# Altium schematic sheet WiFi-BLE Module.SchDoc: WiFi GPRS Combo
size A4; SheetSize: A4
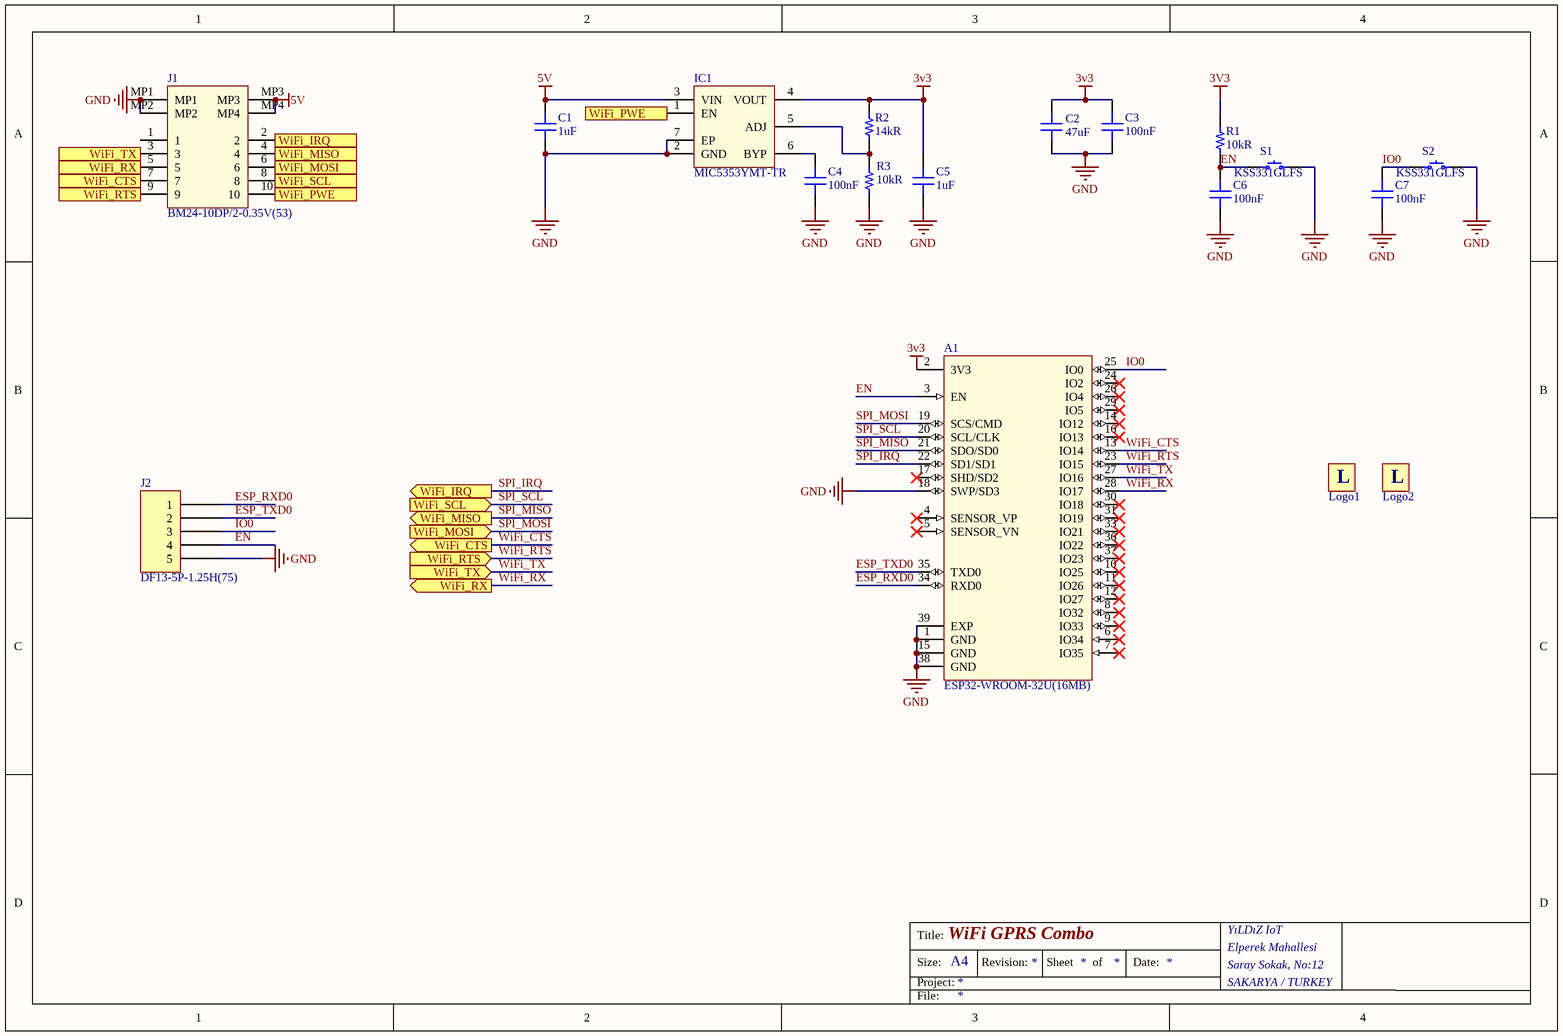
[diagram p0: WiFi-BLE Module.SchDoc]

## Parts
A1  ESP32-WROOM-32U(16MB)  [ESP32-WROOM-32U]
C1  1uF  [CAP 0603/1608]
C2  47uF  [CAP 0603/1608]
C3  100nF  [CAP 0603/1608]
C4  100nF  [CAP 0603/1608]
C5  1uF  [CAP 0603/1608]
C6  100nF  [CAP 0603/1608]
C7  100nF  [CAP 0603/1608]
IC1  MIC5353YMT-TR  [MICREL MLF-6 1.6x1.6MM]
J1  BM24-10DP/2-0.35V(53)  [HIROSE BM2410DP]
J2  DF13-5P-1.25H(75)  [HIROSE DF13-5P-1.25H]  (no BOM)
Logo1  Logo symbol  [LOGO_YILDIZIOT]  (value not drawn)  (no BOM)
Logo2  Logo symbol  [LOGO_YILDIZIOT]  (value not drawn)  (no BOM)
R1  10kR  [RES 0603/1608]
R2  14kR  [RES 0603/1608]
R3  10kR  [RES 0603/1608]
S1  KSS331GLFS  [C&K KSS]  (no BOM)
S2  KSS331GLFS  [C&K KSS]  (no BOM)

## Ports
WiFi_CTS (in), WiFi_CTS (out), WiFi_IRQ (in), WiFi_IRQ (out), WiFi_MISO (in), WiFi_MISO (out), WiFi_MOSI (in), WiFi_MOSI (out), WiFi_PWE (in), WiFi_PWE (out), WiFi_RTS (in), WiFi_RTS (out), WiFi_RX (in), WiFi_RX (out), WiFi_SCL (in), WiFi_SCL (out), WiFi_TX (in), WiFi_TX (out)

## Nets
3v3: A1.2(3V3) C2.2 C3.2 C5.2 IC1.4(VOUT) R1.2 R2.2
5V: C1.2 IC1.3(VIN) J1.MP3 J1.MP4
GND: A1.1(GND) A1.15(GND) A1.18(SWP/SD3) A1.38(GND) A1.39(EXP) C1.1 C2.1 C3.1 C4.1 C5.1 C6.1 C7.1 IC1.2(GND) IC1.7(EP) J1.MP1 J1.MP2 J2.5 R3.2 S1.2 S2.1
EN: A1.3(EN) C6.2 J2.4 R1.1 S1.1
ESP_RXD0: A1.34(RXD0) J2.1
ESP_TXD0: A1.35(TXD0) J2.2
IO0: A1.25(IO0) C7.2 J2.3 S2.2
SPI_IRQ: A1.22(SD1/SD1) J1.2 ; port WiFi_IRQ
SPI_MISO: A1.21(SDO/SD0) J1.4 ; port WiFi_MISO
SPI_MOSI: A1.19(SCS/CMD) J1.6 ; port WiFi_MOSI
SPI_SCL: A1.20(SCL/CLK) J1.8 ; port WiFi_SCL
WiFi_CTS: A1.13(IO14) J1.7 ; port WiFi_CTS
WiFi_PWE: IC1.1(EN) J1.10 ; port WiFi_PWE
WiFi_RTS: A1.23(IO15) J1.9 ; port WiFi_RTS
WiFi_RX: A1.28(IO17) J1.5 ; port WiFi_RX
WiFi_TX: A1.27(IO16) J1.3 ; port WiFi_TX
NetC4_2: C4.2 IC1.6(BYP)
NetIC1_5: IC1.5(ADJ) R2.1 R3.1

Not connected (* = marked no-connect by the designer): A1 4(SENSOR_VP)* 5(SENSOR_VN)* 6(IO34)* 7(IO35)* 8(IO32)* 9(IO33)* 10(IO25)* 11(IO26)* 12(IO27)* 14(IO12)* 16(IO13)* 17(SHD/SD2)* 24(IO2)* 26(IO4)* 29(IO5)* 30(IO18)* 31(IO19)* 33(IO21)* 36(IO22)* 37(IO23)*; J1 1

## Notes on the sheet
- Title:
- Size:
- Project:
- Revision:
- Sheet
- of
- Date:
- YıLDıZ IoT
- Elperek Mahallesi
- Saray Sokak, No:12
- SAKARYA / TURKEY
- File:
- (in symbol Logo) L

## Library data of the parts
A1 = ESP ESP32-WROOM-32U: Wi-Fi/BT BLE Module ESP32-D0WD SPI Flash UART U.FL Conn.; Manufacturer: Espressif Systems; Supplier 1: Digi-Key; Supplier Part Number 1: 1904-1028-1-ND; Manufacturer Part Number: ESP32-WROOM-32U(16MB); Stock 1: 37; Pricing 1: 1 = 4,50000 (USD); RoHS: No; ComponentLink1URL: https://www.espressif.com/sites/default/files/documentation/esp32-wroom-32d_esp32-wroom-32u_datasheet_en.pdf?src-supplier=Digi-Key; ComponentLink1Description: https://www.espressif.com/sites/default/files/documentation/esp32-wroom-32d_esp32-wroom-32u_datasheet_en.pdf?src-supplier=Digi-Key
C1 C5 = Capacitor - Ceramic: Ceramic, SMT Capacitor; Manufacturer: Samsung; Manufacturer Part Number: CL10A105KP8NNNC; Tolerance: 10%; Voltage Rating: 10V; Dielectric: X5R; Supplier 1: Digi-Key; Supplier Part Number 1: 1276-1182-1-ND; Stock 1: 4590831; Pricing 1: 1 = 0,10000, 10 = 0,03800, 100 = 0,01680, 500 = 0,01200, 1000 = 0,00943 (USD); RoHS: Yes; Mount: Surface Mount; Case/Package: 0603; Case Code (Metric): 1608; Case Code (Imperial): 0603; Contact Plating: Tin; Min Operating Temperature: -55°C; Max Operating Temperature: 85°C; Packaging: Tape and Reel; Package Quantity: 1; Capacitance: 1uF; Voltage: 10V; Length: 1.6mm; Height: 0.8mm; Width: 0.031inch; Thickness: 0.035inch; Depth: 0.8mm; Radiation Hardening: No; ComponentLink1URL: https://datasheet.ciiva.com/15195/getdatasheetpartid-358616-15195708.pdf?src-supplier=Verical; ComponentLink1Description: https://datasheet.ciiva.com/15195/getdatasheetpartid-358616-15195708.pdf?src-supplier=Verical; ComponentLink2URL: https://datasheet.ciiva.com/16358/cl05b104kq5nnnc-16358431.pdf?src-supplier=Future+Electronics; ComponentLink2Description: https://datasheet.ciiva.com/16358/cl05b104kq5nnnc-16358431.pdf?src-supplier=Future+Electronics
C2 = Capacitor - Ceramic: Ceramic, SMT Capacitor; Manufacturer: Murata; Manufacturer Part Number: GRM32EC81C476KE15K; Voltage Rating (DC): 16V; Dielectric: X6S; Tolerance: 10%; ComponentLink1URL: http://www.samsungsem.com/kr/support/product-search/mlcc/CL10A475KO8NNNC.jsp; ComponentLink1Description: http://www.samsungsem.com/kr/support/product-search/mlcc/CL10A475KO8NNNC.jsp; ComponentLink2URL: https://www.verical.com/server-webapp/html/getDatasheet?partID=358619; ComponentLink2Description: https://www.verical.com/server-webapp/html/getDatasheet?partID=358619; ComponentLink3URL: https://produktinfo.conrad.com/datenblaetter/450000-474999/457663-da-01-en-VS_KONDENSATOR_0603.pdf; ComponentLink3Description: https://produktinfo.conrad.com/datenblaetter/450000-474999/457663-da-01-en-VS_KONDENSATOR_0603.pdf; ComponentLink4URL: https://www.yuden.co.jp/productdata/catalog/mlcc01_e.pdf; ComponentLink4Description: https://www.yuden.co.jp/productdata/catalog/mlcc01_e.pdf; ComponentLink5URL: https://www.verical.com/server-webapp/html/getDatasheet?partID=637532; ComponentLink5Description: https://www.verical.com/server-webapp/html/getDatasheet?partID=637532; ComponentLink6URL: http://www.yuden.co.jp/ut/product/category/capacitor/EMK325BJ476MM-T.pdf; ComponentLink6Description: http://www.yuden.co.jp/ut/product/category/capacitor/EMK325BJ476MM-T.pdf; ComponentLink7URL: http://www.farnell.com/datasheets/1693457.pdf; ComponentLink7Description: http://www.farnell.com/datasheets/1693457.pdf; ComponentLink8URL: http://www.mouser.com/ds/2/396/mlcc_all_e-1149778.pdf; ComponentLink8Description: http://www.mouser.com/ds/2/396/mlcc_all_e-1149778.pdf; ComponentLink9URL: http://www.onlinecomponents.com/productFiles/mf-TAI/75emk325bj476mm-t.pdf; ComponentLink9Description: http://www.onlinecomponents.com/productFiles/mf-TAI/75emk325bj476mm-t.pdf; Supplier 1: Digi-Key; Supplier Part Number 1: 490-16309-1-ND; Stock 1: 2282; Pricing 1: 1 = 0,78000, 10 = 0,57100, 100 = 0,39170, 500 = 0,31006, 1000 = 0,26110 (USD); Case/Package: 1210; Capacitance: 47uF; Length: 3.2mm; Width: 2.5mm; Thickness: 2.5mm; Price: 0,78
C3 C4 C6 C7 = Capacitor - Ceramic: Ceramic, SMT Capacitor; Manufacturer: Samsung; Manufacturer Part Number: CL10B104JB8NNNC; Tolerance: 5%; Voltage Rating: 50V; Dielectric: X7R; Supplier 1: Digi-Key; Supplier Part Number 1: 1276-1033-1-ND; Stock 1: 223594; Pricing 1: 1 = 0,10000, 10 = 0,05300, 100 = 0,02350, 500 = 0,01680, 1000 = 0,01320 (USD); RoHS: Yes; Mount: Surface Mount; Case/Package: 0603; Case Code (Metric): 1608; Case Code (Imperial): 0603; Material: Ceramic; Contact Plating: Tin; Min Operating Temperature: -55°C; Max Operating Temperature: 125°C; Packaging: Tape and Reel; Package Quantity: 1; Capacitance: 100nF; Voltage: 50V; Length: 1.6mm; Height: 0.8mm; Width: 0.031inch; Thickness: 0.035inch; Depth: 0.8mm; Radiation Hardening: No; ComponentLink1URL: https://media.digikey.com/pdf/Data%20Sheets/Samsung%20PDFs/CL_Series_MLCC_ds.pdf?src-supplier=Digi-Key; ComponentLink1Description: https://media.digikey.com/pdf/Data%20Sheets/Samsung%20PDFs/CL_Series_MLCC_ds.pdf?src-supplier=Digi-Key; ComponentLink2URL: https://www.verical.com/server-webapp/html/getDatasheet?partID=359321&src-supplier=Verical; ComponentLink2Description: https://www.verical.com/server-webapp/html/getDatasheet?partID=359321&src-supplier=Verical; ComponentLink3URL: http://www1.futureelectronics.com/doc/SAMSUNG/CL10B104JB8NNNC.pdf?src-supplier=Future+Electronics; ComponentLink3Description: http://www1.futureelectronics.com/doc/SAMSUNG/CL10B104JB8NNNC.pdf?src-supplier=Future+Electronics; ComponentLink4URL: https://produktinfo.conrad.com/datenblaetter/450000-474999/456613-da-01-en-VS_KONDENSATOR_0603.pdf?src-supplier=Conrad; ComponentLink4Description: https://produktinfo.conrad.com/datenblaetter/450000-474999/456613-da-01-en-VS_KONDENSATOR_0603.pdf?src-supplier=Conrad
IC1 = MICROCHIP MIC5353: Integrated Circuit; ComponentLink1URL: http://www.farnell.com/datasheets/2245202.pdf?src-supplier=Farnell; ComponentLink1Description: http://www.farnell.com/datasheets/2245202.pdf?src-supplier=Farnell; ComponentLink2URL: http://www.microchip.com/mymicrochip/filehandler.aspx?ddocname=en579989&src-supplier=Digi-Key; ComponentLink2Description: http://www.microchip.com/mymicrochip/filehandler.aspx?ddocname=en579989&src-supplier=Digi-Key; ComponentLink3URL: http://www.farnell.com/datasheets/1692673.pdf?src-supplier=Element14; ComponentLink3Description: http://www.farnell.com/datasheets/1692673.pdf?src-supplier=Element14; Supplier 1: Digi-Key; Supplier Part Number 1: 576-3681-1-ND; Manufacturer: Microchip; Manufacturer Part Number: MIC5353YMT-TR; Stock 1: 1004; Pricing 1: 1 = 0,34000, 25 = 0,28000, 100 = 0,26000 (USD); RoHS: Yes; ComponentLink4URL: https://datasheet.ciiva.com/2049/mic5353-2049344.pdf?src-supplier=Digi-Key; ComponentLink4Description: https://datasheet.ciiva.com/2049/mic5353-2049344.pdf?src-supplier=Digi-Key; ComponentLink5URL: https://datasheet.ciiva.com/2049/mic5353-2049342.pdf?src-supplier=Digi-Key; ComponentLink5Description: https://datasheet.ciiva.com/2049/mic5353-2049342.pdf?src-supplier=Digi-Key; ComponentLink6URL: https://datasheet.ciiva.com/2049/mic5353-2049343.pdf?src-supplier=Digi-Key; ComponentLink6Description: https://datasheet.ciiva.com/2049/mic5353-2049343.pdf?src-supplier=Digi-Key
J1 = 12 Pin (10 + 2 Power) B2B Header: Board to Board Connector; Manufacturer: Hirose; Pitch: 0.014inch; Mated Stacking Heights: 0.8mm; Supplier 1: Digi-Key; Supplier Part Number 1: H124923CT-ND; Manufacturer Part Number: BM24-10DP/2-0.35V(53); Stock 1: 2583; Pricing 1: 1 = 1,08000, 10 = 0,95400, 25 = 0,89760, 50 = 0,86020, 100 = 0,82280, 250 = 0,74800, 500 = 0,67320 (USD); RoHS: Yes; Mount: Surface Mount; Number of Pins: 10; Contact Plating: Gold; Packaging: Tape and Reel; Number of Rows: 2; ComponentLink1URL: https://media.digikey.com/pdf/Data%20Sheets/Hirose%20PDFs/BM24.pdf?src-supplier=Digi-Key; ComponentLink1Description: https://media.digikey.com/pdf/Data%20Sheets/Hirose%20PDFs/BM24.pdf?src-supplier=Digi-Key; ComponentLink2URL: https://www.hirose.com/product/en/download_file/key_name/BM24-10DP__2-0.35V%2853%29/category/Specification%20Sheet/doc_file_id/87039/?file_category_id=9&item_id=06772001953&is_series=&src-supplier=Digi-Key; ComponentLink2Description: https://www.hirose.com/product/en/download_file/key_name/BM24-10DP__2-0.35V%2853%29/category/Specification%20Sheet/doc_file_id/87039/?file_category_id=9&item_id=06772001953&is_series=&src-supplier=Digi-Key
J2 = DF13-5P-1.25H(75): CONN HEADER SMD R/A 5POS 1.25MM; Manufacturer: Hirose Electric Co Ltd; Current Rating (Amps): 1A; Material Flammability Rating: UL94 V-0; Number of Positions: 5; Number of Positions Loaded: All; Pitch - Mating: 0.049" (1.25mm); Shrouding: Shrouded - 4 Wall; Style: Board to Cable/Wire; Voltage Rating: 150V; Part Number: DF13-5P-1.25H(75); ComponentLink1Description: Datasheet; ComponentLink1URL: https://www.hirose.com/product/document?clcode=CL0536-0109-0-76&productname=DF13-10P-1.25DSA(76)&series=DF13&documenttype=Catalog&lang=en&documentid=D31687_en; ComponentLink2Description: DigiKey Link; ComponentLink2URL: //digikey.com/product-detail/en/hirose-electric-co-ltd/DF13-5P-1.25H-75/H126404-ND/9170639; Connector Type: Header; Contact Finish - Mating: Tin; Contact Finish - Post: Tin; Contact Finish Thickness - Mating: 39.4µin (1.00µm); Contact Material: Brass; Contact Shape: Square; Contact Type: Male Pin; Fastening Type: Detent Lock; Features: Board Guide, Solder Retention; Insulation Color: Beige; Insulation Height: 0.142" (3.60mm); Insulation Material: Polyamide (PA), Nylon; LastUpdated: 16.12.2019 19:23:39; Lifecycle Status: 0; Minimum Order: 1; Mounting Type: Surface Mount, Right Angle; Number of Rows: 1; Operating Temperature: -35°C ~ 85°C; Packaging: Tube; PartId: 4; Part Status: Active; Price: 0.48; Series: DF13; Supplier 1: DigiKey; Supplier Part Number 1: H126404-ND; Termination: Solder
Logo1 Logo2 = Logo: Schematic symbol for Logo
R1 R3 = Resistor_Chip: Ceramic, SMT Capacitor; Manufacturer: Stackpole Electronics; Manufacturer Part Number: RNCP0603FTD10K0; Tolerance: 1%; Max Power Dissipation: 125mW; Temperature Coefficient: 100ppm/°C; Supplier 1: Digi-Key; Supplier Part Number 1: RNCP0603FTD10K0CT-ND; Stock 1: 183083; Pricing 1: 1 = 0,10000, 10 = 0,06700, 100 = 0,02730, 1000 = 0,01224, 2500 = 0,01063 (USD); RoHS: Yes; Mount: Surface Mount; Case/Package: 0603; Case Code (Metric): 1608; Case Code (Imperial): 0603; Contact Plating: Matte,Tin; Min Operating Temperature: -55°C; Max Operating Temperature: 155°C; Packaging: Tape and Reel; Resistance: 10kR; Composition: Thin Film; Number of Terminations: 2; Features: Anti-Sulfur,Moisture Resistant; Length: 0.059inch; Height: 0.02inch; Width: 0.031inch; Radiation Hardening: No; Lead Free: Lead Free
R2 = Resistor_Chip: Ceramic, SMT Capacitor; Manufacturer: Yageo; Manufacturer Part Number: RC0603FR-0714KL; Tolerance: 1%; Power Rating: 100mW; Voltage Rating: 75V; Temperature Coefficient: 100ppm/°C; Voltage Rating (DC): 50V; Supplier 1: Digi-Key; Supplier Part Number 1: 311-14.0KHRCT-ND; Stock 1: 622097; Pricing 1: 1 = 0,10000, 10 = 0,02300, 100 = 0,00940, 1000 = 0,00421, 2500 = 0,00366 (USD); RoHS: Yes; Case/Package: 0603; Weight: 7.1E-05oz; Case Code (Metric): 1608; Case Code (Imperial): 0603; Min Operating Temperature: -55°C; Max Operating Temperature: 155°C; Resistance: 14kR; Packaging: Tape and Reel; Package Quantity: 1; Max Power Dissipation: 100mW; Features: Moisture Resistant; Composition: Thick Film; Number of Terminations: 2; Termination: SMD/SMT; Military Standard: Not; Length: 1.6mm; Height: 0.022inch; Width: 0.031inch; Depth: 0.8mm; Lead Free: Lead Free; ComponentLink1URL: https://datasheet.ciiva.com/15189/getdatasheetpartid-325152-15189610.pdf?src-supplier=Verical; ComponentLink1Description: https://datasheet.ciiva.com/15189/getdatasheetpartid-325152-15189610.pdf?src-supplier=Verical; ComponentLink2URL: https://datasheet.ciiva.com/2455/pyu-r-int-thick-7-2455089.pdf?src-supplier=Digi-Key; ComponentLink2Description: https://datasheet.ciiva.com/2455/pyu-r-int-thick-7-2455089.pdf?src-supplier=Digi-Key; ComponentLink3URL: https://datasheet.ciiva.com/2455/pyu-r-int-thick-7-2455090.pdf?src-supplier=Digi-Key; ComponentLink3Description: https://datasheet.ciiva.com/2455/pyu-r-int-thick-7-2455090.pdf?src-supplier=Digi-Key; ComponentLink4URL: https://datasheet.ciiva.com/2455/pyu-r-int-thick-7-2455091.pdf?src-supplier=Digi-Key; ComponentLink4Description: https://datasheet.ciiva.com/2455/pyu-r-int-thick-7-2455091.pdf?src-supplier=Digi-Key
S1 S2 = KSS331GLFS: SWITCH TACTILE SPST-NO 0.05A 50V; Manufacturer: C&K; Actuator Orientation: Side Actuated; Actuator Type: Rectangular Button; Contact Rating @ Voltage: 0.05A @ 50VDC; Illumination: Non-Illuminated; Ingress Protection: IP40; Operating Force: 250gf; Outline: 7.60mm x 3.70mm; Switch Function: Off-Mom; Part Number: KSS331GLFS; Circuit: SPST-NO; ComponentLink1Description: Datasheet; ComponentLink1URL: https://dznh3ojzb2azq.cloudfront.net/products/Tactile/KSS/documents/datasheet.pdf; ComponentLink2Description: DigiKey Link; ComponentLink2URL: http://digikey.com/product-detail/en/c-k/KSS331GLFS/401-1101-1-ND/417673; Features: Tactile Feedback; LastUpdated: 09.04.2020 09:55:46; Lifecycle Status: Active; Minimum Order: 1; Mounting Type: Surface Mount, Right Angle; Operating Temperature: -40°C ~ 85°C; Packaging: TapeAndReel; Part Status: Active; Price: 0.35; Series: KSS; Supplier 1: DigiKey; Supplier Part Number 1: 401-1101-1-ND; Termination Style: Gull Wing